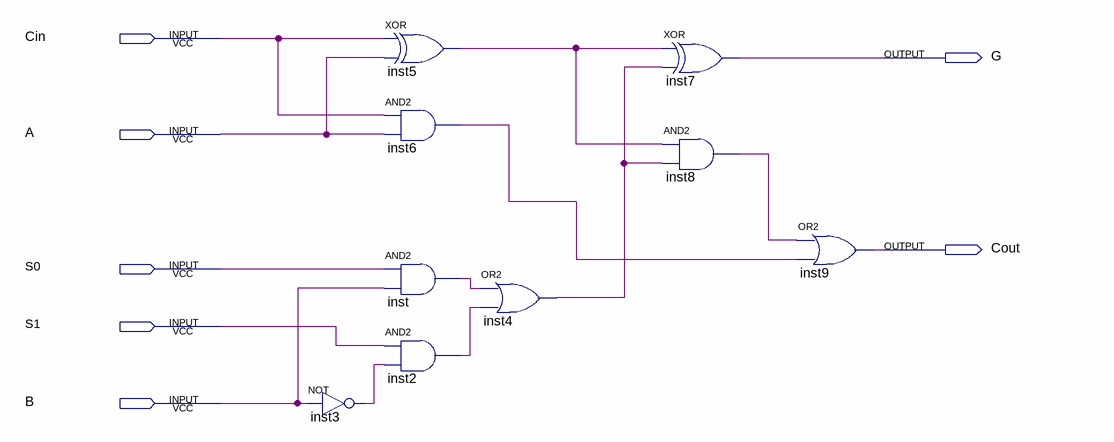
[diagram p0: schematic sheet]
// Quartus schematic Operand_Logic.bdf as structural Verilog: 9 symbols, 7 pins
module Operand_Logic (
  input  Cin,
  input  A,
  input  S0,
  input  S1,
  input  B,
  output G,
  output Cout
);

  wire inst2_out, inst3_out, inst4_out, inst5_out, inst6_out, inst8_out, inst_out;

  not inst3 (inst3_out, B);
  xor inst5 (inst5_out, Cin, A);
  and inst6 (inst6_out, Cin, A);
  and inst (inst_out, S0, B);
  and inst2 (inst2_out, S1, inst3_out);
  or inst4 (inst4_out, inst_out, inst2_out);
  xor inst7 (G, inst5_out, inst4_out);
  and inst8 (inst8_out, inst5_out, inst4_out);
  or inst9 (Cout, inst8_out, inst6_out);
endmodule
